# EAGLE board TL-WR703N (EAGLE 6.1), part 1 of 2
TL-WR703N TP-Link 150MB 802.11n Wi-Fi Router Copyright &copy; 2012, Michel Stempin, All rights reserved Licenced under Creative Commons CC BY-SA 3.0 license.
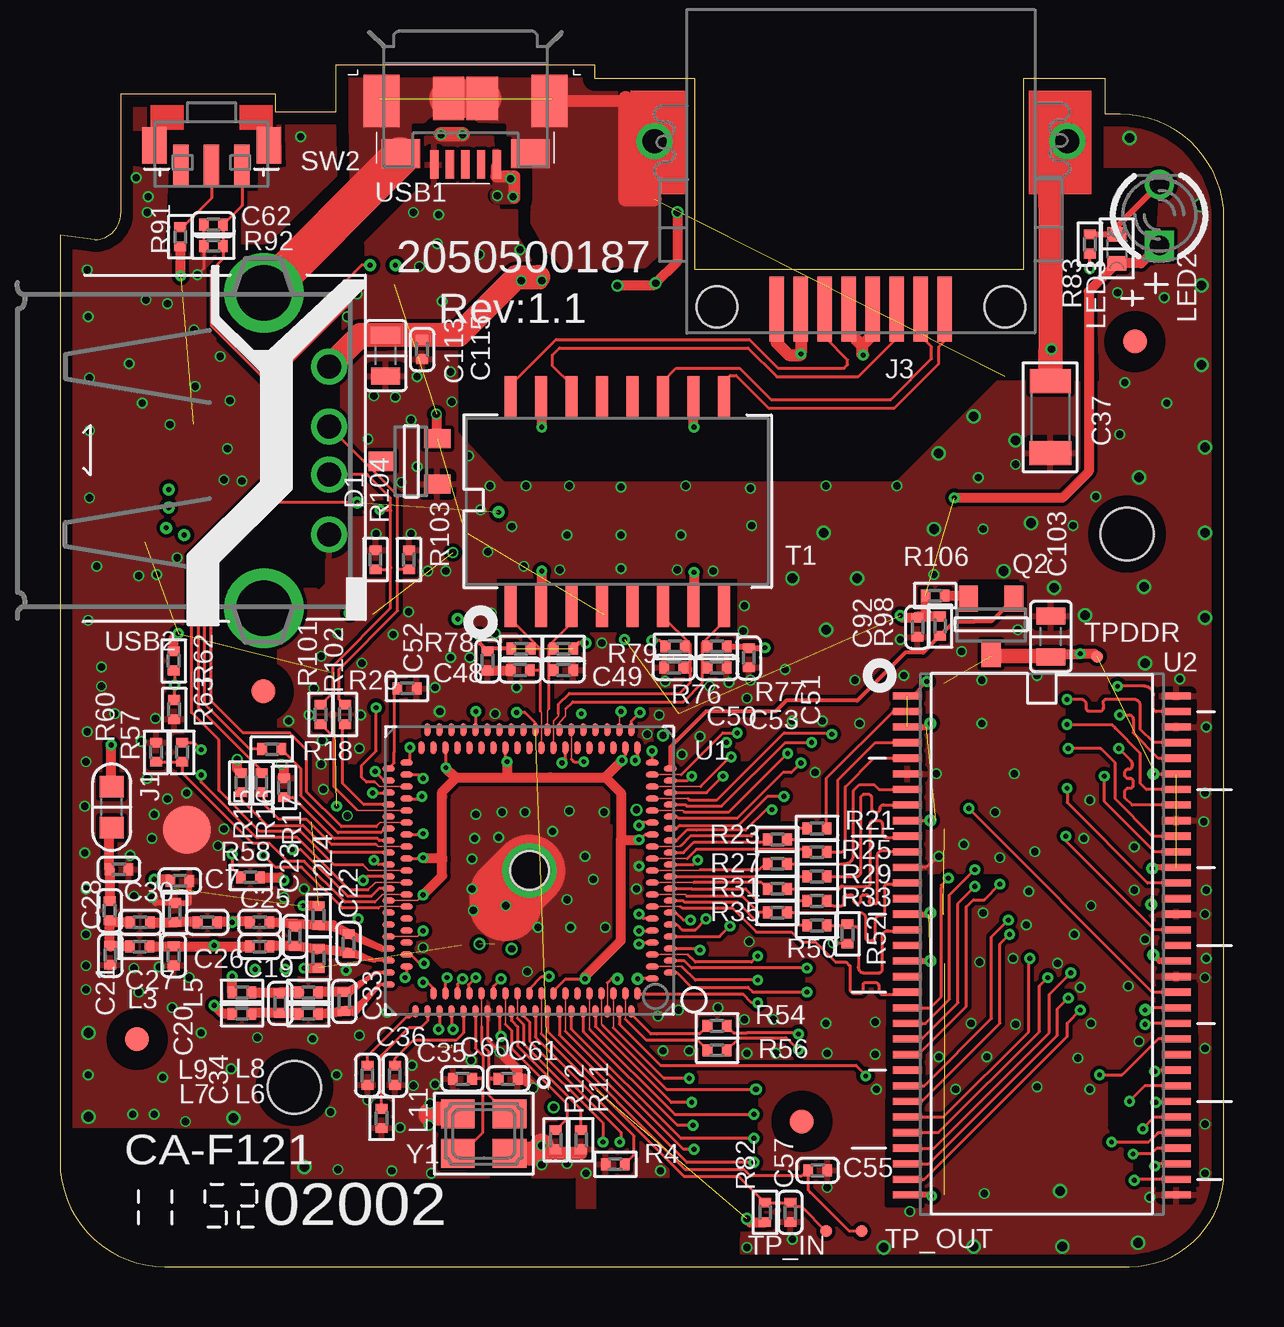
[diagram p2: board, top side]
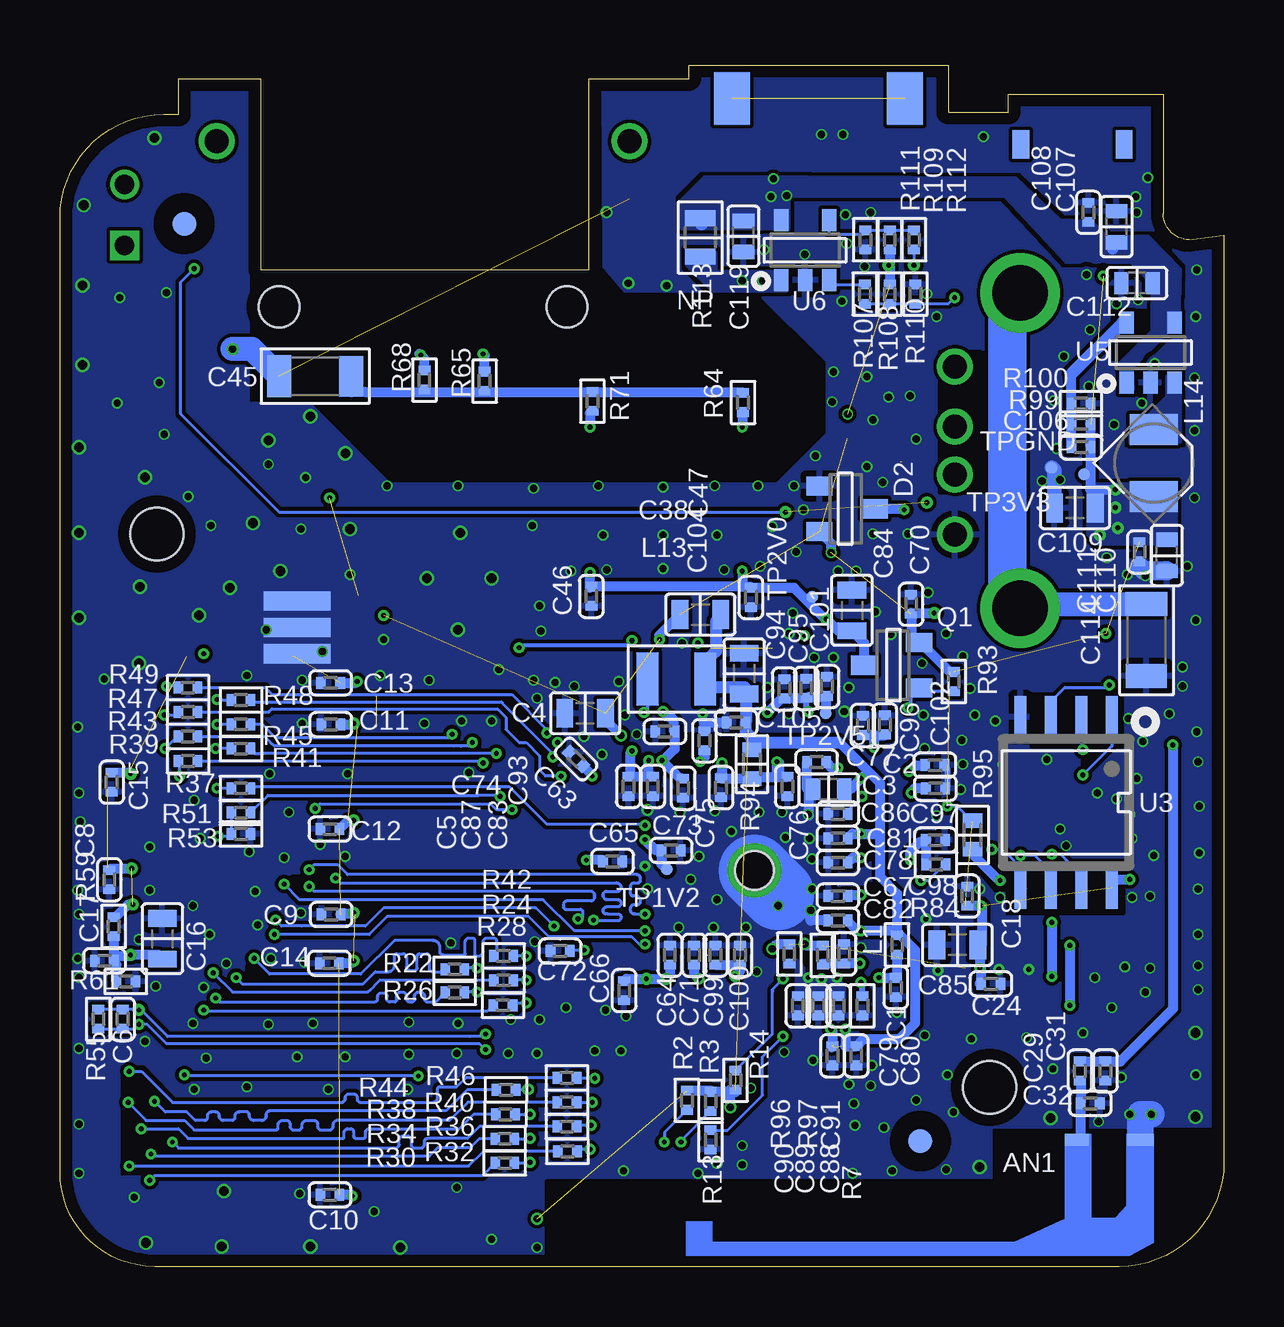
[diagram p3: board, bottom side, seen from below]

Size 48.52 x 50.08 mm. Coordinates in mm from the lower left corner, seen from the top.
Outline: 2.53,48.86 8.98,48.86 8.98,48.11 11.49,48.11 11.49,50.08 22.31,50.08 22.31,49.51 26.47,49.51 26.47,41.55 40.16,41.55 40.16,49.51 43.57,49.51 43.57,48.03 44.19,48.03 arc-90 48.52,43.7 48.52,3.94 arc-90 44.58,0 4.37,0 arc-90 0,4.37 0,43 1.44,42.8
Outline: 2.53,48.86 2.53,43.88
Outline: 1.44,42.8 1.57,42.8 1.68,42.83 1.78,42.86 1.88,42.89 1.98,42.94 2.08,43 2.18,43.08 2.26,43.17 2.37,43.3 2.45,43.47 2.51,43.66 2.53,43.78 2.53,43.88
Copper layers (1*16): Top 0.035mm / dielectric 1mm / Bottom 0.035mm
Design rules: minimum track width 8mil, minimum drill 2mil, track to track 6mil, track to pad 8mil, pad to pad 8mil, via to via 8mil, smd to smd 8mil, copper to edge 20mil, drill to drill 6mil, minimum pad ring 2mil, minimum via ring 2mil, stop-mask expansion 4mil, vias tented up to drill 16mil, thermal gap 10mil
Net classes: 1 RF: clearance 0.508 mm; 2 Power: clearance 0.305 mm
Holes 2.2 mm at 9.77,7.47 44.48,30.53
Holes 1.6 mm at 19.57,16.51

## Footprints (pad centres in the part's own frame; a part is rotated, then mirrored left to right if it is on the bottom)
WIFI_ANTENNA = smd 1.1 x 0.5: GND 2.45,0 | smd 1 x 0.5: RF -0.2,0
C0402 = smd 0.4 x 0.5: 1 -0.4,0; 2 0.4,0
C0603 = smd 0.9 x 0.6: 1 0,0.65; 2 0,-0.65
C0805 = smd 0.7 x 1.2: 1 -0.85,0; 2 0.85,0
C1206 = smd 1 x 1.75: 1 -1.5,0 | smd 1 x 1.7: 2 1.5,0
SOT23-3 = smd 0.8 x 1.1: 1 -0.95,-1.1; 2 0.95,-1.1; 3 0,1.2
FIDUCIAL = smd 1 x 1: 1 0,0
SHIELD_PAD = smd 2 x 2: 1 0,0
GND_3CONTACT = smd 2.8 x 0.8: GND$1 0,1.1; GND$2 0,0; GND$3 0,-1.1
J0603 = smd 0.9 x 1: 1 -0.85,0; 2 0.85,0
RJ45_LP_RA_SMT = smd 0.6 x 2.7: 1 -3.5,0; 2 -2.5,0; 3 -1.5,0; 4 -0.5,0; 5 0.5,0; 6 1.5,0; 7 2.5,0; 8 3.5,0 | drill 1: S$1 -8.6,7; S$2 8.6,7 | hole 1.7: -6,0.1; 6,0.1
L0402 = smd 0.4 x 0.5: 1 -0.4,0; 2 0.4,0
L1008 = smd 2.2 x 0.9: 1 0,1.2; 2 0,-1.2
FERRITE_SELF = smd 2 x 1.3: 1 0,1.4; 2 0,-1.4
LED3MM = drill 0.813 square: A -1.27,0 | drill 0.813: K 1.27,0
LED0603 = smd 0.8 x 0.6: A 0,-0.6; C 0,0.6
R0402 = smd 0.4 x 0.5: 1 -0.4,0; 2 0.4,0
R0603 = smd 0.8 x 0.6: 1 0,0.6; 2 0,-0.6
R0805 = smd 1.27 x 0.66: 1 0,0.8; 2 0,-0.8
TACT_SWITCH_SPST_RA_SMT = smd 0.635 x 1.778: 1 -1.27,0; 2 0,0; 3 1.27,0 | smd 0.7 x 1.2 bottom: P$1 -2.15,0.9; P$2 2.15,0.9 | smd 1.016 x 1.524: S$1 -2.386,0.862; S$2 2.386,0.862
H1601CG = smd 0.5 x 1.8: 1 -4.445,-4.35; 2 -3.175,-4.35; 3 -1.905,-4.35; 4 -0.635,-4.35; 5 0.635,-4.35; 6 1.905,-4.35; 7 3.175,-4.35; 8 4.445,-4.35; 9 4.445,4.325; 10 3.175,4.325; 11 1.905,4.325; 12 0.635,4.325; 13 -0.635,4.325; 14 -1.905,4.325; 15 -3.175,4.325; 16 -4.445,4.325
TEST_PAD = smd 0.5 x 0.5: 1 0,0
DRMLF164 = smd 0.52 x 0.24: A3 -5.869,4.25; A4 -5.869,3.75; A5 -5.869,3.25; A6 -5.869,2.75; A7 -5.869,2.25; A8 -5.869,1.75; A9 -5.869,1.25; A10 -5.869,0.75; A11 -5.869,0.25; A12 -5.869,-0.25; A13 -5.869,-0.75; A14 -5.869,-1.25; A15 -5.869,-1.75; A16 -5.869,-2.25; A17 -5.869,-2.75; A18 -5.869,-3.25; A19 -5.869,-3.75; A20 -5.869,-4.25; A47 5.869,-4.25; A48 5.869,-3.75; A49 5.869,-3.25; A50 5.869,-2.75; A51 5.869,-2.25; A52 5.869,-1.75; A53 5.869,-1.25; A54 5.869,-0.75; A55 5.869,-0.25; A56 5.869,0.25; A57 5.869,0.75; A58 5.869,1.25; A59 5.869,1.75; A60 5.869,2.25; A61 5.869,2.75; A62 5.869,3.25; A63 5.869,3.75; A64 5.869,4.25; A65 5.869,4.75; B1 -5.119,4.5; B2 -5.119,4; B3 -5.119,3.5; B4 -5.119,3; B5 -5.119,2.5; B6 -5.119,2; B7 -5.119,1.5; B8 -5.119,1; B9 -5.119,0.5; B10 -5.119,0; B11 -5.119,-0.5; B12 -5.119,-1; B13 -5.119,-1.5; B14 -5.119,-2; B15 -5.119,-2.5; B16 -5.119,-3; B17 -5.119,-3.5; B18 -5.119,-4; B19 -5.119,-4.5; B39 5.119,-4.5; B40 5.119,-4; B41 5.119,-3.5; B42 5.119,-3; B43 5.119,-2.5; B44 5.119,-2; B45 5.119,-1.5; B46 5.119,-1; B47 5.119,-0.5; B48 5.119,0; B49 5.119,0.5; B50 5.119,1; B51 5.119,1.5; B52 5.119,2; B53 5.119,2.5; B54 5.119,3; B55 5.119,3.5; B56 5.119,4 | smd 0.24 x 0.52: A25 -4.25,-5.869; A26 -3.75,-5.869; A27 -3.25,-5.869; A28 -2.75,-5.869; A29 -2.25,-5.869; A30 -1.75,-5.869; A31 -1.25,-5.869; A32 -0.75,-5.869; A33 -0.25,-5.869; A34 0.25,-5.869; A35 0.75,-5.869; A36 1.25,-5.869; A37 1.75,-5.869; A38 2.25,-5.869; A39 2.75,-5.869; A40 3.25,-5.869; A41 3.75,-5.869; A42 4.25,-5.869; A68 4.75,5.869; A69 4.25,5.869; A70 3.75,5.869; A71 3.25,5.869; A72 2.75,5.869; A73 2.25,5.869; A74 1.75,5.869; A75 1.25,5.869; A76 0.75,5.869; A77 0.25,5.869; A78 -0.25,5.869; A79 -0.75,5.869; A80 -1.25,5.869; A81 -1.75,5.869; A82 -2.25,5.869; A83 -2.75,5.869; A84 -3.25,5.869; A85 -3.75,5.869; A86 -4.25,5.869; B20 -4.5,-5.119; B21 -4,-5.119; B22 -3.5,-5.119; B23 -3,-5.119; B24 -2.5,-5.119; B25 -2,-5.119; B26 -1.5,-5.119; B27 -1,-5.119; B28 -0.5,-5.119; B29 0,-5.119; B30 0.5,-5.119; B31 1,-5.119; B32 1.5,-5.119; B33 2,-5.119; B34 2.5,-5.119; B35 3,-5.119; B36 3.5,-5.119; B37 4,-5.119; B38 4.5,-5.119; B59 4,5.119; B60 3.5,5.119; B61 3,5.119; B62 2.5,5.119; B63 2,5.119; B64 1.5,5.119; B65 1,5.119; B66 0.5,5.119; B67 0,5.119; B68 -0.5,5.119; B69 -1,5.119; B70 -1.5,5.119; B71 -2,5.119; B72 -2.5,5.119; B73 -3,5.119; B74 -3.5,5.119; B75 -4,5.119; B76 -4.5,5.119 | drill 1.5: PAD 0,0
TSOP66 = smd 1.2 x 0.3: 1 -5.6,10.4; 2 -5.6,9.75; 3 -5.6,9.1; 4 -5.6,8.45; 5 -5.6,7.8; 6 -5.6,7.15; 7 -5.6,6.5; 8 -5.6,5.85; 9 -5.6,5.2; 10 -5.6,4.55; 11 -5.6,3.9; 12 -5.6,3.25; 13 -5.6,2.6; 14 -5.6,1.95; 15 -5.6,1.3; 16 -5.6,0.65; 17 -5.6,0; 18 -5.6,-0.65; 19 -5.6,-1.3; 20 -5.6,-1.95; 21 -5.6,-2.6; 22 -5.6,-3.25; 23 -5.6,-3.9; 24 -5.6,-4.55; 25 -5.6,-5.2; 26 -5.6,-5.85; 27 -5.6,-6.5; 28 -5.6,-7.15; 29 -5.6,-7.8; 30 -5.6,-8.45; 31 -5.6,-9.1; 32 -5.6,-9.75; 33 -5.6,-10.4; 34 5.6,-10.4; 35 5.6,-9.75; 36 5.6,-9.1; 37 5.6,-8.45; 38 5.6,-7.8; 39 5.6,-7.15; 40 5.6,-6.5; 41 5.6,-5.85; 42 5.6,-5.2; 43 5.6,-4.55; 44 5.6,-3.9; 45 5.6,-3.25; 46 5.6,-2.6; 47 5.6,-1.95; 48 5.6,-1.3; 49 5.6,-0.65; 50 5.6,0; 51 5.6,0.65; 52 5.6,1.3; 53 5.6,1.95; 54 5.6,2.6; 55 5.6,3.25; 56 5.6,3.9; 57 5.6,4.55; 58 5.6,5.2; 59 5.6,5.85; 60 5.6,6.5; 61 5.6,7.15; 62 5.6,7.8; 63 5.6,8.45; 64 5.6,9.1; 65 5.6,9.75; 66 5.6,10.4
SOP8 = smd 0.508 x 1.778: 1 -1.905,-3.556; 2 -0.635,-3.556; 3 0.635,-3.556; 4 1.905,-3.556; 5 1.905,3.556; 6 0.635,3.556; 7 -0.635,3.556; 8 -1.905,3.556
SOT23-5 = smd 0.6 x 0.9: 1 -1,-1.25; 2 0,-1.25; 3 1,-1.25; 4 1,1.25; 5 -1,1.25
USB-MICROB = smd 0.35 x 1.2: D+ 0,2.65; D- -0.65,2.65; GND 1.3,2.65; ID 0.65,2.65; VBUS -1.3,2.65 | smd 1.5 x 2.2 bottom: P$1 -3.6,-0.1; P$2 3.6,-0.1 | smd 1.5 x 2.2: S$1 -3.5,0; S$6 3.5,0 | smd 1.6 x 1.2: S$2 -2.7,2.2; S$5 2.7,2.2 | smd 1.3 x 1.8: S$3 -0.7,-0.1; S$4 0.7,-0.1
USB-A_TH = drill 1: 1 -3.5,12.99; 2 -1,12.99; 3 1,12.99; 4 3.5,12.99 | drill 2.3 pad 2.8: S$1 -6.57,10.28; S$2 6.57,10.28
CRYSTAL_32_25 = smd 1.4 x 1.2: 1 -1.075,-0.825; 2 1.075,-0.825; 3 1.075,0.825; 4 -1.075,0.825

## Placement (x,y rotation side)
AN1  WIFI_ANTENNA  [WIFI_ANTENNA]  5.93,5.29 0 bottom
C1  1n  [C0402]  13.68,11.63 270 bottom
C2  10n  [C0402]  12.05,20.9 0 bottom
C3  1u 0603  [C0603]  16.48,19.89 270 bottom
C4  10u 0805  [C0805]  26.63,23.06 0 bottom
C5  100n  [C0402]  24.83,20.01 270 bottom
C6  NP  [C0402]  45.9,10.31 90 bottom
C7  100n  [C0402]  5,16.08 0 top
C8  10n  [C0402]  46.46,16.12 270 bottom
C9  10n  [C0402]  37.22,14.68 0 bottom
C10  10n  [C0402]  37.27,2.99 0 bottom
C11  10n  [C0402]  37.23,22.59 0 bottom
C12  10n  [C0402]  37.27,18.23 0 bottom
C13  10n  [C0402]  37.24,24.33 0 bottom
C14  10n  [C0402]  37.29,12.65 0 bottom
C15  10n  [C0402]  46.36,20.19 270 bottom
C16  10u 0805  [C0805]  44.25,13.66 270 bottom
C17  1n  [C0402]  46.66,12.75 0 bottom
C18  12p  [C0402]  10.71,15.44 90 bottom
C19  12p  [C0402]  8.32,13.33 0 top
C20  1p2  [C0402]  4.74,12.95 90 top
C21  1p2  [C0402]  2.1,12.98 90 top
C22  2p4  [C0402]  12.03,13.46 90 top
C23  NP  [C0402]  9.79,13.77 90 top
C24  10p  [C0402]  9.72,11.78 0 bottom
C25  12p  [C0402]  8.32,14.35 0 top
C26  2p4  [C0402]  6.14,14.35 0 top
C27  1p6  [C0402]  3.35,14.35 0 top
C28  12p  [C0402]  2.08,14.83 90 top
C29  0n  [C0402]  6.01,8.15 270 bottom
C30  low ind  [C0402]  2.46,16.56 0 top
C31  0p5  [C0402]  4.94,8.15 270 bottom
C32  NP  [C0402]  5.58,6.8 180 bottom
C33  2p4  [C0402]  11.85,11.05 90 top
C34  2p4  [C0402]  9.18,10.97 90 top
C35  100n  [C0402]  13.96,7.97 90 top
C36  50R  [C0402]  12.82,7.97 90 top
C37  1n 1206  [C1206]  41.28,35.41 90 top
C38  10u 0805  [C0805]  21.83,27.17 180 bottom
C45  1n 1206  [C1206]  37.88,37.11 0 bottom
C46  100n  [C0402]  26.37,27.94 270 bottom
C47  10n  [C0402]  19.72,27.89 270 bottom
C48  12p  [C0402]  19.19,24.87 0 top
C49  12p  [C0402]  20.99,24.87 0 top
C50  12p  [C0402]  25.59,24.96 0 top
C51  100n  [C0402]  28.71,25.37 90 top
C52  100n  [C0402]  17.82,25.25 90 top
C53  12p  [C0402]  27.39,24.96 0 top
C55  NP  [C0402]  31.58,4.01 0 top
C57  NP  [C0402]  30.44,2.26 90 top
C60  12p  [C0402]  16.78,7.82 0 top
C61  12p  [C0402]  18.68,7.82 0 top
C62  100p  [C0402]  6.39,43.43 0 top
C63  10n  [C0402]  27.01,21.16 315 bottom
C64  10n  [C0402]  23.1,12.98 270 bottom
C65  10n  [C0402]  25.48,16.89 0 bottom
C66  10n  [C0402]  25,11.5 90 bottom
C67  10n  [C0402]  16.09,15.44 0 bottom
C70  10n  [C0402]  13.04,27.61 270 bottom
C71  10n  [C0402]  22.08,12.98 270 bottom
C72  10n  [C0402]  27.67,13.15 0 bottom
C73  10n  [C0402]  23.05,17.35 0 bottom
C74  10n  [C0402]  23.3,22.3 0 bottom
C75  10n  [C0402]  20.97,19.96 270 bottom
C76  10n  [C0402]  18.2,20.01 270 bottom
C77  10n  [C0402]  16.98,21.03 0 bottom
C78  10n  [C0402]  16.09,16.84 0 bottom
C79  10n  [C0402]  16.32,8.79 270 bottom
C80  10n  [C0402]  15.33,8.79 270 bottom
C81  10n  [C0402]  16.09,17.85 0 bottom
C82  10n  [C0402]  16.09,14.42 0 bottom
C83  10n  [C0402]  22.54,19.94 270 bottom
C84  10u 0805  [C0805]  15.51,27.35 270 bottom
C85  22u 0805  [C0805]  11.12,13.41 0 bottom
C86  10n  [C0402]  16.09,18.87 0 bottom
C87  10n  [C0402]  23.81,20.01 270 bottom
C88  10n  [C0402]  16.06,10.87 270 bottom
C89  10n  [C0402]  16.9,10.87 270 bottom
C90  10n  [C0402]  17.77,10.87 270 bottom
C91  10n  [C0402]  15.84,13.03 270 bottom
C92  10n  [C0402]  35.74,26.64 90 top
C93  10n  [C0402]  21.65,21.92 270 bottom
C94  10n  [C0402]  18.33,24.08 270 bottom
C95  100n  [C0402]  17.41,24.1 270 bottom
C96  100n  [C0402]  15.05,22.56 270 bottom
C97  10n  [C0402]  12.03,19.94 0 bottom
C98  10n  [C0402]  12.03,17.78 0 bottom
C99  10n  [C0402]  21.19,12.98 270 bottom
C100  100n  [C0402]  20.18,12.98 270 bottom
C101  10n  [C0402]  16.55,24.18 270 bottom
C102  10n  [C0402]  14.14,22.58 270 bottom
C103  10u 0805  [C0805]  41.31,26.26 90 top
C104  22u 0805  [C0805]  20,24.71 90 bottom
C105  100n  [C0402]  20.33,22.68 180 bottom
C106  22p  [C0402]  5.96,34.16 0 bottom
C107  4u7 0603  [C0603]  4.48,43.34 0 bottom
C108  100n  [C0402]  5.65,43.94 270 bottom
C109  10u 0805  [C0805]  6.21,31.62 0 bottom
C110  NP  [C0603]  2.38,29.64 0 bottom
C111  100n  [C0402]  3.52,29.79 270 bottom
C112  4u7 0603  [C0603]  3.63,40.99 270 bottom
C113  10u 0805  [C0805]  13.58,37.97 90 top
C114  1n 1206  [C1206]  3.24,26.11 270 bottom
C115  100n  [C0402]  15.1,38.22 90 top
C119  1u 0603  [C0603]  20.03,42.94 0 bottom
D1  MMBD7000  [SOT23-3]  14.62,33.56 90 top
D2  MMBD7000  [SOT23-3]  15.76,31.59 270 bottom
E$1  FIDUCIAL  [FIDUCIAL]  3.22,9.47 0 top
E$2  FIDUCIAL  [FIDUCIAL]  30.92,6.05 0 top
E$3  FIDUCIAL  [FIDUCIAL]  44.81,38.55 0 top
E$4  FIDUCIAL  [FIDUCIAL]  8.48,23.98 0 top
E$5  FIDUCIAL  [FIDUCIAL]  43.33,43.46 0 bottom
E$6  FIDUCIAL  [FIDUCIAL]  12.66,5.23 0 bottom
E$7  CC-BY-SA  [CC-BY-SA]  49.97,10.51 0 top
GND  TEST_PAD_SHIELD  [SHIELD_PAD]  5.3,18.21 0 top
GND_CONTACTS  GND_3CONTACTS  [GND_3CONTACT]  38.63,26.64 0 bottom
J1  JUMPER  [J0603]  2.15,19.15 90 top
J3  RJ45_2SH  [RJ45_LP_RA_SMT]  33.38,39.9 0 top
L1  0R  [L0402]  13.63,13.41 90 bottom
L2  low ind  [L0402]  10.78,12.85 90 top
L3  low ind  [L0402]  3.32,13.33 0 top
L4  low ind  [L0402]  10.78,14.63 90 top
L5  low ind  [L0402]  4.79,14.75 90 top
L6  low ind  [L0402]  10.35,10.54 180 top
L7  low ind  [L0402]  7.59,10.54 180 top
L8  low ind  [L0402]  10.35,11.43 180 top
L9  low ind  [L0402]  7.59,11.43 180 top
L11  50R  [L0402]  13.4,6.17 90 top
L13  1u  [L1008]  22.83,24.49 270 bottom
L14  4u  [FERRITE_SELF]  2.93,33.49 180 bottom
LED2  NP  [LED3MM]  45.82,43.84 90 top
LED3  Blue LED  [LED0603]  44.05,42.41 0 top
Q1  S8550M  [SOT23-3]  13.81,25.07 90 bottom
Q2  S8550M  [SOT23-3]  38.82,26.74 180 top
R2  10k  [R0402]  22.39,6.93 270 bottom
R3  10k  [R0402]  21.4,6.88 270 bottom
R4  10k  [R0402]  23.15,4.27 180 top
R7  6k2  [R0402]  15.08,10.87 270 bottom
R11  10k  [R0402]  21.73,5.28 90 top
R12  10k  [R0402]  20.66,5.28 90 top
R13  10k  [R0402]  21.4,5.28 270 bottom
R14  10k  [R0402]  20.36,7.77 270 bottom
R15  10k  [R0402]  7.56,20.17 270 top
R16  0R  [R0402]  8.4,20.17 270 top
R17  10k  [R0402]  9.34,19.96 270 top
R18  0R  [R0402]  8.83,21.56 0 top
R20  2k4  [R0402]  14.47,24.1 0 top
R21  22R  [R0402]  31.55,18.26 180 top
R22  22R  [R0402]  32.06,12.39 180 bottom
R23  22R  [R0402]  29.9,17.8 180 top
R24  22R  [R0402]  30.03,11.93 180 bottom
R25  22R  [R0402]  31.55,17.27 180 top
R26  22R  [R0402]  32.06,11.43 180 bottom
R27  22R  [R0402]  29.9,16.79 180 top
R28  22R  [R0402]  30.06,10.89 180 bottom
R29  22R  [R0402]  31.55,16.26 180 top
R30  22R  [R0402]  29.98,4.31 180 bottom
R31  22R  [R0402]  29.9,15.75 180 top
R32  22R  [R0402]  27.37,4.8 180 bottom
R33  22R  [R0402]  31.55,15.24 180 top
R34  22R  [R0402]  29.98,5.33 180 bottom
R35  22R  [R0402]  29.9,14.75 180 top
R36  22R  [R0402]  27.39,5.84 180 bottom
R37  22R  [R0402]  40.98,19.94 180 bottom
R38  22R  [R0402]  29.95,6.35 180 bottom
R39  22R  [R0402]  43.18,21.08 180 bottom
R40  22R  [R0402]  27.39,6.85 180 bottom
R41  22R  [R0402]  40.98,21.59 180 bottom
R42  22R  [R0402]  30.03,12.95 180 bottom
R43  22R  [R0402]  43.18,22.09 180 bottom
R44  22R  [R0402]  29.93,7.36 180 bottom
R45  22R  [R0402]  40.98,22.6 180 bottom
R46  22R  [R0402]  27.39,7.87 180 bottom
R47  22R  [R0402]  43.18,23.11 180 bottom
R48  22R  [R0402]  40.98,23.62 180 bottom
R49  22R  [R0402]  43.18,24.13 180 bottom
R50  22R  [R0402]  31.55,14.22 180 top
R51  22R  [R0402]  40.98,18.92 180 bottom
R52  10k  [R0402]  32.82,13.87 270 top
R53  10k  [R0402]  40.98,18.03 180 bottom
R54  22R  [R0402]  27.39,10.03 0 top
R55  100R  [R0402]  46.92,10.31 90 bottom
R56  22R  [R0402]  27.39,9.02 0 top
R57  1k  [R0402]  5.1,21.44 270 top
R58  10k  [R0402]  7.94,16.23 180 top
R59  6k2  [R0402]  46.28,14.17 270 bottom
R60  3k  [R0402]  4.01,21.44 270 top
R61  6k2  [R0402]  45.77,11.88 0 bottom
R62  10k  [R0402]  4.74,25.25 270 top
R63  NP  [R0402]  4.76,23.21 270 top
R64  75R  [R0402]  20.05,36.01 270 bottom
R65  75R  [R0402]  30.82,36.9 270 bottom
R68  75R  [R0402]  33.33,36.95 270 bottom
R71  75R  [R0402]  26.32,36.06 270 bottom
R76  50R  [R0402]  25.64,25.85 0 top
R77  50R  [R0402]  27.39,25.85 0 top
R78  50R  [R0402]  19.22,25.75 0 top
R79  50R  [R0402]  20.99,25.75 0 top
R82  10k  [R0402]  29.39,2.26 90 top
R83  3k8  [R0402]  42.93,42.62 90 top
R84  10k  [R0402]  12,16.76 0 bottom
R91  1k  [R0402]  5.02,42.92 90 top
R92  3k  [R0402]  6.39,42.54 0 top
R93  NP  [R0402]  11.27,24.38 90 bottom
R94  0R 0603  [R0603]  19.68,20.94 0 bottom
R95  10R 0603  [R0603]  10.48,17.99 0 bottom
R96  0R  [R0402]  18.12,13.03 90 bottom
R97  0R  [R0402]  16.73,12.98 90 bottom
R98  NP  [R0402]  36.68,26.69 90 top
R99  299k  [R0402]  5.96,35.12 0 bottom
R100  66k4  [R0402]  5.96,35.96 180 bottom
R101  0R  [R0402]  10.86,23.01 270 top
R102  0R  [R0402]  11.88,23.01 270 top
R103  NP  [R0402]  14.54,29.46 90 top
R104  NP  [R0402]  13.15,29.46 90 top
R106  0R  [R0402]  36.48,27.96 180 top
R107  0R  [R0402]  14.97,40.53 90 bottom
R108  1k  [R0402]  13.93,40.53 90 bottom
R109  1k  [R0402]  13.93,42.79 90 bottom
R110  3k  [R0402]  12.87,40.53 90 bottom
R111  3k  [R0402]  14.95,42.79 90 bottom
R112  0R  [R0402]  12.92,42.79 90 bottom
R113  NP  [R0805]  21.83,42.89 0 bottom
SW2  TACT_SWITCH_SPST  [TACT_SWITCH_SPST_RA_SMT]  6.32,45.87 0 top
T1  ETH10_100_TRANSFO  [H1601CG]  23.23,31.9 0 top
TP1V2  TEST_PAD  [TEST_PAD]  23.23,16.56 0 bottom
TP2V0  TEST_PAD  [TEST_PAD]  17.16,27.91 0 bottom
TP2V5  TEST_PAD  [TEST_PAD]  16.6,23.06 0 bottom
TP3V3  TEST_PAD  [TEST_PAD]  5.83,33.02 0 bottom
TP_IN  TEST_PAD  [TEST_PAD]  31.93,1.47 0 top
TP_OUT  TEST_PAD  [TEST_PAD]  33.41,1.47 0 top
TPDDR  TEST_PAD  [TEST_PAD]  43.23,25.42 0 top
TPGND  TEST_PAD  [TEST_PAD]  7.18,33.3 0 bottom
U1  AR9331-AL1A  [DRMLF164]  19.57,16.51 180 top
U2  A3S56F40FTP  [TSOP66]  40.92,13.38 0 top
U3  S25FL032P0XMFI01  [SOP8]  6.58,19.34 180 bottom
U5  UNKNOWN_BUCK  [SOT23-5]  3.06,38.1 0 bottom
U6  TPS2041BDBV  [SOT23-5]  17.46,42.36 0 bottom
USB1  USB-MICROB  [USB-MICROB]  16.9,48.59 180 top
USB2  USB-A_TH  [USB-A_TH]  -1.78,34.01 270 top
Y1  25.00 MHz  [CRYSTAL_32_25]  17.66,5.54 180 top

## Tracks (layer width: path | path; a pad name or v marks a point on that pad's centre or on a via)
!CAS  (via drill 0.2 pad 0.45)
  Top 0.127: U2.22 36.07,10.13 37.08,11.14 37.08,15.49 38.03,16.44 v38.13,16.54 | U1.B6 24.31,14.51 v24.13,14.69 | v24.13,14.69 | v24.13,14.69
  Bottom 0.127: v38.13,16.54 37.93,16.74 36.93,16.74 36.53,16.34 24.48,16.34 arc90 24.33,16.19 24.33,16.09 arc90 24.43,15.99 24.58,15.99 arc-90 24.73,15.84 24.73,15.54 arc-90 24.63,15.44 24.48,15.44 arc90 24.33,15.29 24.33,15.19 arc90 24.43,15.09 24.58,15.09 arc-90 24.73,14.94 24.73,14.84 arc-90 24.58,14.69 | 24.53,14.69 24.58,14.69 | 24.58,14.69 v24.13,14.69 | v24.13,14.69 | v24.13,14.69
!CLK
  Top 0.127: U1.A86 23.82,10.5 24.63,9.69 24.88,9.69 26.65,9.69 R54.1
!CLK_B  (via drill 0.2 pad 0.45, 0.2 pad 0.5)
  Top 0.127: U2.46 45.32,10.79 v45.23,10.69 | v30.78,9.69 30.73,9.74 28.63,9.74 28.08,9.74 R54.2
  Bottom 0.127: 31.43,9.59 44.03,9.59 45.13,10.69 v45.23,10.69 45.28,10.74 45.93,10.74 | 46.83,10.71 46.83,10.69 | 46.83,10.71 46.8,10.74 45.93,10.74 | v30.78,9.69 30.88,9.59 31.43,9.59 | 46.83,10.71 R55.2 | C6.2 45.93,10.74 | 31.43,9.59 | 31.43,9.59
!CS  (via drill 0.2 pad 0.45)
  Top 0.127: U2.24 35.77,8.83 37.78,10.84 37.78,14.99 38.08,15.29 38.53,15.29 v39.18,15.94 | v24.13,13.99 24.67,13.99 U1.B5
  Bottom 0.127: v24.13,13.99 27.08,13.99 28.38,15.29 38.53,15.29 v39.18,15.94
!RAS  (via drill 0.2 pad 0.45)
  Top 0.127: U1.A7 25.71,14.26 25.93,14.04 26.48,14.04 v26.93,14.49 | U2.23 35.92,9.48 37.43,10.99 37.43,15.14 v38.13,15.84
  Bottom 0.127: v38.13,15.84 37.93,15.64 26.38,15.64 arc90 26.23,15.44 arc90 26.38,15.24 27.38,15.24 arc-90 27.53,15.09 27.53,14.99 arc-90 27.43,14.89 26.83,14.89 arc90 26.73,14.79 26.73,14.59 arc90 26.83,14.49 v26.93,14.49
!SPI_CS_0  (via drill 0.2 pad 0.45)
  Top 0.064: U1.B49 13.15,16.01 12.83,15.69
  Top 0.127: 8.18,17.89 5.88,20.19 v5.88,20.49 | 12.83,15.69 12.08,15.69 9.88,17.89 8.28,17.89 | 8.28,17.89 8.18,17.89 | 8.18,17.89 8.28,17.89 | 8.28,17.89
  Bottom 0.127: U3.1 4.68,21.7 v5.88,20.49
!SPI_W  (via drill 0.2 pad 0.45)
  Top 0.127: R62.2 4.78,24.85 v4.78,24.24 | R63.1 4.78,23.61 v4.78,24.24 | v4.78,24.24 | v4.78,24.24
  Bottom 0.127: v4.78,24.24 4.88,24.14 6.63,24.14 7.22,23.56 U3.3
!WE  (via drill 0.2 pad 0.45)
  Top 0.127: U1.A8 25.66,14.76 25.98,14.44 v26.28,14.44 | U2.21 36.27,10.79 36.73,11.24 36.73,15.79 36.73,15.89 v37.03,16.19
  Bottom 0.127: v37.03,16.19 36.83,15.99 25.33,15.99 arc90 25.13,15.79 arc90 25.28,15.64 25.73,15.64 arc-90 25.88,15.49 arc-90 25.73,15.29 25.28,15.29 arc90 25.13,15.14 arc90 25.28,14.99 25.73,14.99 arc-90 25.88,14.84 arc-90 25.78,14.69 25.68,14.69 25.23,14.69 arc90 25.13,14.54 arc90 25.26,14.42 26.26,14.42 v26.28,14.44
$28  (via drill 0.2 pad 0.45)  (1 unrouted)
  Top 0.127: 17.83,25.64 C52.2
  Top 0.175: v21.93,25.99 21.63,25.99 R79.2 | R78.1 17.94,25.75 17.83,25.64 | v17.48,26.29 17.48,25.98 C52.2
+1V2  (via drill 0.2 pad 0.45)
  Top 0.064: U1.A58 14.9,15.26 v15.13,15.49 | U1.A26 23.32,22.88 23.43,22.99
  Top 0.127: v21.88,11.99 21.08,11.99 20.57,11.48 U1.B69 | U1.B36 16.07,20.8 v16.08,20.79 | v16.08,20.79 | v16.08,20.79 | v20.93,20.99 21.08,21.14 21.08,21.49 | 21.08,21.49 21.08,21.64 | U1.B26 21.07,21.5 21.08,21.49 | U1.B21 23.58,21.64 23.58,21.34 23.33,21.09 v23.43,21.09 | U1.B47 15.15,17.01 15.18,17.04 v15.13,17.04 | v15.13,17.04 | v15.13,17.04 | 24.18,17.79 24.39,18 U1.B13 24.68,17.99 U1.B13 | v24.13,17.79 24.18,17.79 | 24.18,17.79 | 18.53,21.59 U1.B31 18.57,21.1 v18.63,21.04 | 23.43,22.99 23.43,23.09 v23.38,23.14 | v23.43,21.09 | 22.78,20.39 22.78,20.34 22.81,20.32
  Top 0.406: v15.13,15.49 15.93,16.29 15.93,16.94 | 15.93,16.94 15.93,16.99 15.93,19.59 15.93,19.79 16.53,20.39 | 23.38,17.79 v24.13,17.79 23.38,17.79 | 23.38,17.79 23.38,13.59 21.88,12.09 v21.88,11.99 | 16.53,20.39 18.63,20.39 | 18.63,20.39 | 18.63,20.39 | 18.63,20.39 20.43,20.39 22.68,20.39 22.73,20.39 22.81,20.32 23.38,19.74 23.38,17.79 | 23.38,17.79 | 16.53,20.39 16.48,20.39 v16.08,20.79 | v18.63,21.04 18.63,20.39 | 18.63,20.39 | v15.13,17.04 15.18,17.04 15.93,17.04 15.93,16.94 | 22.78,20.39 22.78,20.44 v23.43,21.09
  Bottom 0.127: 22.93,22.79 23.03,22.79 v23.38,23.14 | v23.43,21.09 | v23.43,21.09 | 20.98,20.39 20.98,20.38 C75.1 | 15.68,15.49 C67.2 | v21.88,11.99 | v21.88,11.99
  Bottom 0.406: v20.93,20.99 20.93,20.44 | 20.93,20.44 20.98,20.39 20.98,20.49 | 18.53,20.41 19.68,20.41 R94.2 20.93,20.34 20.93,20.44 | 18.53,20.41 C76.1 18.53,20.41 | C71.2 22.08,12.19 v21.88,11.99 | v24.13,17.79 23.68,17.35 C73.1 23.45,16.78 TP1V2.1 | C83.1 22.57,20.34 22.67,20.34 v23.43,21.09 23.38,21.09 22.98,21.49 22.9,21.57 C74.2 22.93,22.33 22.93,22.79 | 18.53,20.41 18.53,20.99 | v15.13,17.04 15.49,17.04 C78.2 | C77.2 16.34,20.79 v16.08,20.79 | v23.38,23.14 23.13,22.89 23.03,22.89 | 15.68,15.49 v15.13,15.49 | v15.13,15.49 | 18.53,20.41 18.55,20.39 18.63,20.39 | 18.63,20.39 | 18.63,20.39 v18.63,21.04
+2V0  (via drill 0.2 pad 0.45, 0.2 pad 0.5)
  Top 0.406: v20.08,28.99 20.08,27.54 20.08,27.55 T1.2 | v26.43,28.94 26.43,28.29 26.43,27.54 26.43,27.55 T1.7
  Bottom 0.127: v16.58,26.99 | v16.58,26.99
  Bottom 0.406: Q1.3 15.01,26 C84.2 16.09,26.5 v16.58,26.99 | TP2V0.1 17.21,27.91 17.21,27.86 17.36,27.72 | v16.58,26.99 16.58,26.94 | v26.43,28.94 26.43,28.29 26.43,28.34 C46.1 20.08,28.34 | v20.08,28.99 20.08,28.34 | 20.08,28.34 19.73,28.34 19.72,28.34 C47.1 17.92,28.29 17.36,27.72 | 17.36,27.72 16.63,26.99 v16.58,26.99
+2V5  (via drill 0.2 pad 0.45, 0.3 pad 0.5)  (2 unrouted)
  Top 0.127: v17.33,23.14 17.33,22.39 17.32,22.39 U1.A38 | v17.33,23.14 | v17.33,23.14 | v19.03,23.09 19.38,23.09 19.82,22.65 U1.A33 | R82.1 29.38,1.84
  Top 0.406: v28.63,1.99 28.78,1.84 29.38,1.84
  Bottom 0.127: 17.28,23.74 17.41,23.74 C95.2 17.43,23.69 | C101.2 16.58,23.78 16.58,23.74
  Bottom 0.254: v17.33,23.14 17.41,23.14 C95.2
  Bottom 0.406: 17.43,23.69 18.33,23.69 C94.2 18.45,23.68 v19.03,23.09 | 17.28,23.74 16.58,23.74 16.53,23.74 16.53,23.7 | C101.2 16.6,23.73 TP2V5.1 | 20.36,7.28 R14.2 20.58,7.37 | v20.58,6.64 20.58,7.37 | R2.1 21.4,7.33 R3.1 20.58,7.28 20.58,7.37
+3V3  (via drill 0.2 pad 0.45, 0.2 pad 0.5, 0.3 pad 0.2, 0.3 pad 0.5)  (16 unrouted)
  Top 0.127: 4.98,42.49 R91.1 5.03,42.49 | L2.1
  Top 0.406: C7.1 4.53,16.14 v3.93,16.14 | R62.1 4.74,26.2 v4.93,26.39 | R98.2 35.8,27.09 C92.2 | 35.7,27.09 C92.2 | R106.2 36.08,27.09 35.73,27.09 35.74,27.08 C92.2 | v35.03,27.14 35.13,27.04 C92.2 | 4.98,42.49 4.99,42.49 | v5.03,41.29 | v5.03,41.29 5.03,42.49 | v15.69,35.53 15.69,34.54 D1.2 | L4.2 10.13,15.03 v10.13,15.04 | v10.13,15.04 | v10.13,15.04 | v10.17,12.45 v10.18,12.44 L2.1 | LED2.A 45.07,41.81 LED3.A 42.88,40.65 42.88,33.14 41.78,32.04 v37.28,32.04
  Bottom 0.127: 5.58,34.24 5.56,34.22 C106.2 | TP3V3.1 5.83,32.99 | v11.53,19.19 11.13,19.19 10.48,18.54 R95.1 | R95.1 | R97.2 16.73,13.39 R97.2 | R97.2 | v10.18,12.44 | v10.18,12.44 | v18.83,13.24 | v18.83,13.24 | 11.43,24.79 11.27,24.79 R93.2 | 12.78,25.99 12.71,25.99 Q1.2 | 13.03,27.24 13.04,27.24 C70.2
  Bottom 0.406: R99.2 5.58,35.12 5.58,34.24 5.58,33.24 | 5.58,33.24 5.83,32.99 | 5.58,33.24 5.58,32.39 v4.53,32.39 | U3.8 4.68,16.14 v3.93,16.14 | C4.2 25.78,22.79 v25.13,22.14 | D2.2 16.38,30.15 16.38,29.75 | R109.1 13.93,41.79 v13.98,41.74 13.93,41.69 R108.2 | v17.48,13.44 17.42,13.38 R97.2 | C85.2 10.13,13.41 | C85.2 10.08,13.41 10.08,15.04 | 10.18,11.78 C24.1 10.12,12.44 v10.18,12.44 10.18,13.41 | C85.2 10.18,13.41 | C85.2 10.18,13.41 | C18.1 v10.13,15.04 10.08,15.04 | 10.08,15.04 | R96.2 18.65,13.43 v18.83,13.24 | 11.43,24.79 12.63,25.99 12.78,25.99 13.03,25.99 13.03,27.14 13.03,27.24 v12.08,27.24 | C38.2 23.53,26.32 v23.53,26.14
  other vias: 4.53,31.64 4.43,30.79 5.18,30.49
  pour Bottom (no thermals): 1.98,32.64 1.98,30.09 5.28,30.09 5.68,30.49 5.68,32.64
+5V0  (via drill 0.3 pad 0.2)
  Top 0.406: 18.18,45.44 18.18,45.89
  Top 0.5: 18.18,45.44 18.93,45.44 18.93,44.54
  Bottom 0.406: 4.66,42.39 4.63,42.39
  Bottom 0.5: C119.1 20.08,43.54
  Bottom 0.6: 21.78,43.49 21.78,43.59
  other vias: 18.23,44.64 18.88,44.59 18.78,45.34
  pour Bottom (no thermals): 4.28,36.44 4.33,37.69 2.98,39.04 2.98,40.94 3.88,41.84 6.58,41.84 9.13,44.59 18.13,44.59 18.13,43.24 22.63,43.24 22.63,44.44 21.63,45.44 8.68,45.39 6.83,43.64 5.53,43.59 5.53,43.59 4.88,42.94 4.88,42.94 3.13,42.94 1.83,41.59 1.88,39.39 3.83,37.44 3.78,36.54
  pour Top (no thermals): 18.28,44.34 18.68,44.34 arc90 19.08,44.59 19.13,45.34 arc90 18.93,45.59 18.28,45.59 18.28,46.54 18.08,46.54 18.08,44.84 arc90 17.98,44.69 17.98,44.54 arc90
A0  (via drill 0.2 pad 0.45)
  Top 0.127: U1.A4 26.01,12.76 26.33,12.44 v31.13,12.44
  Bottom 0.127: v31.13,12.44 31.63,12.44 31.63,12.39 R22.1
A0_B  (via drill 0.2 pad 0.45)
  Top 0.127: U2.29 36.62,5.58 40.83,9.79 40.83,11.69 v41.18,12.04
  Bottom 0.127: v41.18,12.04 40.93,11.79 35.88,11.79 35.38,12.29 34.88,12.29 34.83,12.29 arc-90 34.58,12.54 34.58,12.94 arc90 34.48,13.04 34.23,13.04 arc90 34.08,12.89 34.08,12.49 arc-90 33.93,12.34 33.73,12.34 arc-90 33.63,12.44 33.63,12.94 arc90 33.53,13.04 33.23,13.04 arc90 33.13,12.94 33.13,12.44 arc-90 32.98,12.29 32.63,12.29 32.48,12.44 32.46,12.44 R22.2
A1  (via drill 0.2 pad 0.45)
  Top 0.064: U1.B2 25.91,12.51
  Top 0.127: 25.91,12.51 26.48,11.94 v29.08,11.94
  Bottom 0.127: 29.62,11.94 R24.1 29.63,11.94 v29.08,11.94
A1_B  (via drill 0.2 pad 0.45)
  Top 0.127: U2.30 36.42,4.93 41.23,9.74 41.23,11.34 v42.13,12.24
  Bottom 0.127: v42.13,12.24 41.33,11.44 36.33,11.44 35.68,11.44 35.58,11.54 35.29,11.83 35.19,11.93 R24.2
A2  (via drill 0.2 pad 0.45)
  Top 0.127: U1.A3 25.71,12.26 26.33,11.64 28.68,11.64 28.88,11.44 31.08,11.44 v31.13,11.44
  Bottom 0.127: v31.13,11.44 31.58,11.44 31.63,11.39 31.66,11.39 R26.1
A2_B  (via drill 0.2 pad 0.45)
  Top 0.127: U2.31 36.22,4.29 41.58,9.64 41.58,10.74 v42.03,11.19
  Bottom 0.127: v42.03,11.19 41.88,11.04 35.38,11.04 arc-90 35.28,11.14 35.28,11.24 arc90 35.18,11.39 34.98,11.39 arc90 34.88,11.24 34.88,11.09 arc-90 34.73,11.04 34.58,11.04 arc-90 34.48,11.09 34.48,11.19 34.48,11.24 arc90 34.33,11.44 34.23,11.44 arc90 34.08,11.24 34.08,11.14 arc-90 33.88,11.04 33.83,11.04 arc-90 33.73,11.14 33.73,11.29 arc90 33.58,11.44 33.48,11.44 arc90 33.33,11.29 33.33,11.19 arc-90 33.23,11.04 32.85,11.04 R26.2
A3  (via drill 0.2 pad 0.45)
  Top 0.127: 24.07,11.34 U1.B76 24.12,11.34 28.48,11.34 28.83,10.99 28.88,10.99 v29.08,10.99
  Bottom 0.127: R28.1 29.56,10.99 v29.08,10.99
A3_B  (via drill 0.2 pad 0.45)
  Top 0.127: U2.32 35.32,3.64 36.03,3.64 41.98,9.59 41.98,10.14 v42.53,10.69 | v42.53,10.69 | v42.53,10.69
  Bottom 0.127: R28.2 30.71,10.64 42.23,10.64 42.48,10.64 v42.53,10.69
A4  (via drill 0.2 pad 0.45)
  Top 0.127: v28.93,4.34 26.13,4.34 | U1.A80 20.82,9.65 26.13,4.34 | 26.13,4.34 | 26.13,4.34
  Bottom 0.127: R30.1 28.96,4.31 v28.93,4.34
A4_B  (via drill 0.2 pad 0.45)
  Top 0.127: U2.35 44.82,3.63 v44.78,3.59 | v44.78,3.59 | v44.78,3.59
  Bottom 0.127: v44.78,3.59 44.58,3.79 43.88,3.79 30.9,3.79 R30.2
A5  (via drill 0.2 pad 0.45)
  Top 0.064: U1.B70 21.07,9.8
  Top 0.127: 21.07,9.8 25.98,4.89 v26.43,4.89
  Bottom 0.127: v26.43,4.89 26.98,4.89 | 26.98,4.89 27.08,4.79 | 26.98,4.89 26.97,4.88 R32.1
A5_B  (via drill 0.2 pad 0.45)
  Top 0.127: U2.36 45.72,4.29 v45.63,4.19
  Bottom 0.127: v45.63,4.19 31.48,4.19 30.88,4.79 30.87,4.8 R32.2
A6  (via drill 0.2 pad 0.45)
  Top 0.127: v28.93,5.34 25.88,5.34 21.33,9.89 21.33,10.63 U1.A81
  Bottom 0.127: R34.1 28.94,5.33 | 28.94,5.33 v28.93,5.34 | 28.94,5.33 v28.93,5.34 | v28.93,5.34
A6_B  (via drill 0.2 pad 0.45)
  Top 0.127: U2.37 45.72,4.93 45.48,4.69 v44.73,4.69
  Bottom 0.127: R34.2 31.04,5.33 31.43,4.94 32.78,4.94 33.13,4.59 44.63,4.59 v44.73,4.69
A7  (via drill 0.2 pad 0.45)
  Top 0.127: v26.38,5.89 25.73,5.89 21.83,9.79 21.83,10.64 U1.A82
  Bottom 0.127: v26.38,5.89 26.98,5.89 arc-90 27.03,5.84 R36.1
A7_B  (via drill 0.2 pad 0.45)
  Top 0.127: v43.83,5.19 45.38,5.19 45.73,5.54 45.78,5.59 U2.38 | U2.38 | U2.38 46.53,5.54 46.63,5.54 | 46.63,5.54 46.63,5.49 | U2.38 46.63,5.58 46.63,5.54
  Bottom 0.127: v43.83,5.19 43.58,4.94 34.53,4.94 arc-90 34.38,5.09 34.38,5.29 arc90 34.18,5.44 | 34.18,5.44 34.03,5.44 arc90 33.88,5.24 33.88,5.09 arc-90 33.73,4.94 33.48,4.94 arc-90 33.33,5.09 33.33,5.19 arc90 33.18,5.34 | R36.2 31.04,5.84 31.53,5.34 33.18,5.34 | 33.18,5.34 | 33.18,5.34 | 34.18,5.44 | 34.18,5.44
A8  (via drill 0.2 pad 0.45)
  Top 0.064: U1.B72 22.07,9.9 22.08,9.89
  Top 0.127: 22.08,9.89 25.63,6.34 v28.93,6.34 | v28.93,6.34 | v28.93,6.34
  Bottom 0.127: R38.1 v28.93,6.35 v28.93,6.34
A8_B  (via drill 0.2 pad 0.45)
  Top 0.127: v45.13,5.74 45.62,6.23 U2.39
  Bottom 0.127: R38.2 31.28,6.35 31.88,5.74 35.63,5.74 arc-90 35.78,5.59 35.78,5.44 arc90 35.88,5.34 36.18,5.34 arc90 36.28,5.44 36.28,5.59 arc-90 36.38,5.74 36.53,5.74 arc-90 36.68,5.54 36.68,5.39 arc90 36.73,5.34 43.18,5.34 43.58,5.74 v45.13,5.74
A9  (via drill 0.2 pad 0.45)
  Top 0.127: U1.A83 22.32,10 25.48,6.84 v26.33,6.84
  Bottom 0.127: R40.1 26.32,6.85 v26.33,6.84
A9_B  (via drill 0.2 pad 0.45)
  Top 0.127: v45.68,6.84 | v45.68,6.84 46.43,6.84 46.52,6.84 U2.40
  Bottom 0.127: v45.68,6.84 44.93,6.09 43.33,6.09 42.93,5.69 39.53,5.69 arc-90 39.43,5.79 39.43,5.89 arc90 39.23,6.09 39.08,6.09 arc90 38.93,5.94 38.93,5.84 arc-90 38.78,5.69 38.58,5.69 arc-90 38.43,5.84 38.43,5.89 arc90 38.23,6.09 37.93,6.09 arc90 37.78,5.94 37.78,5.84 arc-90 37.63,5.69 37.28,5.69 arc-90 37.13,5.84 37.13,5.89 arc90 36.98,6.09 32.28,6.09 31.52,6.85 R40.2
A10/AP  (via drill 0.2 pad 0.45)
  Top 0.064: U1.B3 26.16,13.01
  Top 0.127: 26.16,13.01 26.48,12.69 28.83,12.69 v29.08,12.94
  Bottom 0.127: v29.08,12.94 29.53,12.94 R42.1
A10_B/AP_B  (via drill 0.2 pad 0.45)
  Top 0.127: U2.28 36.82,6.23 40.38,9.79 40.38,12.79 v40.43,12.84
  Bottom 0.127: v40.43,12.84 39.78,12.19 35.98,12.19 34.58,13.59 32.98,13.59 arc90 32.68,13.29 32.68,13.09 arc-90 32.53,12.99 31.68,12.99 arc-90 31.63,13.04 31.63,13.54 arc90 31.48,13.69 31.33,13.69 arc90 31.23,13.59 31.23,12.99 arc-90 31.18,12.94 31.08,12.94 arc-90 30.88,13.14 30.88,13.54 arc90 30.73,13.69 30.43,13.69 arc90 30.33,13.59 30.33,13.04 arc90 30.38,12.99 30.38,12.95 R42.2
A11  (via drill 0.2 pad 0.45)
  Top 0.064: 22.63,10.04 22.57,10.1 U1.B73
  Top 0.127: 22.63,10.04 25.28,7.39 v29.03,7.39
  Bottom 0.127: R44.1 29.5,7.39 v29.03,7.39 | v29.03,7.39 | v29.03,7.39 v28.98,7.39
A11_B  (via drill 0.2 pad 0.45)
  Top 0.127: U2.41 45.22,7.54 v44.58,6.89
  Bottom 0.127: R44.2 31.56,7.36 32.43,6.49 39.63,6.49 39.78,6.49 arc-90 39.93,6.29 39.93,6.24 arc90 40.13,6.09 40.43,6.09 arc90 40.63,6.29 40.63,6.34 arc-90 40.73,6.44 41.03,6.44 arc-90 41.23,6.29 41.23,6.24 arc90 41.33,6.09 41.73,6.09 arc90 41.88,6.29 arc-90 42.03,6.44 42.18,6.44 arc-90 42.38,6.29 42.38,6.19 arc90 42.48,6.09 42.88,6.09 43.23,6.44 44.13,6.44 v44.58,6.89
A12  (via drill 0.2 pad 0.45)
  Top 0.064: U1.B74 23.07,9.95
  Top 0.127: 23.07,9.95 25.18,7.84 v26.23,7.84
  Bottom 0.127: v26.23,7.84 26.26,7.87 26.95,7.87 26.98,7.84 R46.1
A12_B  (via drill 0.2 pad 0.45)
  Top 0.127: U2.42 45.67,8.19 45.63,8.14 v45.63,8.13 v45.64,8.13
  Bottom 0.127: v45.64,8.13 45.12,8.13 43.83,6.84 36.83,6.84 36.78,6.84 arc-90 36.63,6.99 36.63,7.04 arc90 36.48,7.19 36.28,7.19 arc90 36.13,7.04 36.13,6.99 arc-90 35.98,6.84 32.98,6.84 arc-90 32.78,7.04 32.78,7.39 arc90 32.68,7.49 31.98,7.49 31.6,7.87 R46.2
ANT1
  Bottom 0.406: AN1.RF 5.98,5.29 C32.2 5.98,7.75 C29.2
ANT1_INN
  Top 0.127: C33.2 11.93,11.45 11.93,11.54
  Top 0.175: U1.A64 13.18,12.24 11.93,11.54 12.08,11.34 13.13,12.24 11.98,11.49
  Top 0.406: C33.2 10.84,11.45 | 10.84,11.45 10.83,11.44 | 10.84,11.45 10.75,11.45 L8.1
ANT1_INP
  Top 0.127: 12.18,10.69 11.85,10.69 C33.1
  Top 0.175: U1.A65 13.33,11.74 | 13.33,11.74 12.18,10.69 12.18,10.54 13.33,11.74 | 13.33,11.74 12.38,10.59
  Top 0.406: 12.24,10.65 C33.1 11.91,10.65 L6.1
ANT1_INT  (via drill 0.2 pad 0.45)
  Top 0.406: J1.2 2.13,20 v2.13,21.74 | v2.13,21.74 | v2.13,21.74
  Bottom 0.406: C29.1 5.04,8.55 | 5.04,8.55 5.03,8.54 | 2.13,10.74 4.32,8.55 C31.1 5.04,8.55 | 2.13,21.64 2.13,21.49 | 2.13,21.49 2.13,10.74 | 2.13,10.74 | v2.13,21.74 | v2.13,21.74 2.13,21.49
ANT1_OUTN
  Top 0.127: C22.2 12,13.89 11.98,13.89
  Top 0.175: U1.A62 13.48,13.29 11.98,13.99 12.08,13.74 13.43,13.19 C22.2 11.98,13.89 | 11.98,13.89 11.98,13.94 11.98,13.89
  Top 0.406: 11.98,13.89 11.48,14.14 11.4,14.23 L4.1 9.89,14.28 | 9.89,14.28 C25.2 | C23.2 9.89,14.17 9.89,14.28
ANT1_OUTP
  Top 0.127: 12.08,13.09 12.03,13.09 C22.1
  Top 0.175: U1.A63 13.03,12.79 12.13,13.19 12.08,12.99 13.13,12.74 12.08,13.09
  Top 0.406: C22.1 11.99,13.1 L2.2 10.72,13.22 C23.1 8.72,13.37 C19.2
BA0  (via drill 0.2 pad 0.45)
  Top 0.127: U2.26 36.02,7.54 38.83,10.34 38.83,13.74 v39.53,14.44 | U1.A6 27.5,13.76 v27.93,14.19
  Bottom 0.127: v27.93,14.19 28.68,14.94 35.03,14.94 35.78,14.19 38.43,14.19 39.28,14.19 v39.53,14.44
BA1  (via drill 0.2 pad 0.45)
  Top 0.127: U2.27 35.92,6.88 39.18,10.14 39.18,13.44 v39.58,13.84 | U1.B4 24.2,13.51 v24.13,13.44
  Bottom 0.127: v39.58,13.84 35.63,13.84 34.88,14.59 28.98,14.59 28.13,13.74 24.68,13.74 24.38,13.44 v24.13,13.44
CKE  (via drill 0.2 pad 0.45)
  Top 0.127: U2.44 45.77,9.48 45.67,9.38 44.28,7.99 v43.33,7.99 | v33.58,7.94 33.58,7.99 33.18,8.39 25.03,8.39 23.32,10.1 U1.A85
  Bottom 0.127: v33.58,7.94 43.33,7.94 v43.33,7.99
CLK
  Top 0.064: U1.B75 23.57,10.3
  Top 0.127: 23.57,10.3 24.43,9.44 26.56,9.44 R56.1
CLK_B  (via drill 0.2 pad 0.45)
  Top 0.127: U2.45 45.27,10.13 v45.23,10.09 | v45.23,10.09 | v45.23,10.09 | R56.2 28.31,9.54 30.28,9.54 | v30.78,9.04 30.28,9.54 | 30.28,9.54
  Bottom 0.127: R55.1 C6.1 45.41,9.91 v45.23,10.09 45.08,10.09 44.88,10.09 44.08,9.29 43.73,9.29 31.13,9.29 31.03,9.29 v30.78,9.04
D+  (via drill 0.2 pad 0.45)
  Top 0.127: R101.1 11.38,23.93 11.38,25.04 13.78,27.44 13.78,29.06 | 13.78,29.06 13.78,29.09 | 13.78,31.49 13.78,29.16 13.78,29.09 | 13.78,31.49 13.78,32.04 12.81,33.01 USB2.3 | R104.1 13.78,29.06 | 13.78,29.06 13.78,29.09 | v13.33,31.54 13.78,31.54 13.78,31.49
  Bottom 0.406: D2.3 13.35,31.59 13.31,31.55 v13.33,31.55 v13.33,31.54
D-  (1 unrouted)
  Top 0.127: R102.1 11.63,23.66 11.63,24.89 14.08,27.34 14.08,29.09 | R103.1 14.08,29.06 14.08,29.09 | 14.08,29.09 14.08,32.09 14.08,32.14 13.01,33.22 12.98,33.24 | 13.33,33.49 13.48,33.49 12.98,33.49 12.98,33.24 | USB2.2 12.98,33.24 | 12.98,33.24
  Top 0.406: 13.48,33.55 13.48,33.49
DQ0
  Top 0.064: U1.B12 25.85,17.51 25.88,17.54
  Top 0.127: R21.2 29.15,18.26 28.83,17.94 26.28,17.94 | 26.28,17.94 | 26.28,17.94 25.88,17.54
DQ0_B
  Top 0.127: R21.1 31.95,20.37 34.73,23.14 35.28,23.14 35.29,23.14 U2.2
DQ1
  Top 0.127: U1.A13 26,17.26 26.43,17.69 29.39,17.69 R23.2
DQ1_B
  Top 0.127: R23.1 32.24,17.8 arc90 32.43,17.99 32.43,20.29 33.93,21.79 33.98,21.84 34.98,21.84 | 34.98,21.84 35.33,21.84 | U2.4 35.33,21.84 | 35.33,21.84 | 35.33,21.84 34.98,21.84
DQ2
  Top 0.064: U1.B11 26.15,17.01
  Top 0.127: R25.2 31.03,17.39 26.53,17.39 26.15,17.01 | 26.15,17.01
DQ2_B
  Top 0.127: R25.1 32.56,17.27 arc90 32.73,17.49 32.73,19.99 33.93,21.19 34.98,21.19 | 34.98,21.19 35.23,21.19 35.28,21.19 U2.5 | U2.5 | U2.5 | U2.5 34.98,21.19
DQ3
  Top 0.064: U1.B10 26.65,16.51 26.68,16.54
  Top 0.127: R27.2 29.38,16.79 29.13,16.54 26.68,16.54
DQ3_B
  Top 0.127: R27.1 32.68,16.79 arc90 33.08,17.14 33.08,19.84 33.33,20.09 33.93,20.09 34.13,19.89 34.14,19.89 U2.7
DQ4
  Top 0.127: U1.A11 R29.2
DQ4B
  Top 0.127: R29.1 33.2,16.26 arc90 33.38,16.44 33.38,19.54 arc-90 33.58,19.69 33.68,19.69 arc-90 33.83,19.49 33.83,19.09 arc90 33.98,18.94 34.08,18.94 arc90 34.18,19.09 arc-90 34.33,19.24 34.98,19.24 | 34.98,19.24 U2.8 | U2.8 | U2.8 | U2.8 34.98,19.24
DQ5
  Top 0.064: U1.B9 26.41,16.01 26.43,15.99
  Top 0.127: R31.2 29.24,16.01 26.41,16.01
DQ5_B
  Top 0.127: R31.1 32.44,15.75 arc90 32.53,15.79 arc-90 32.59,15.85 32.64,15.85 33.59,15.85 arc90 33.78,15.94 33.78,18.44 arc-90 33.88,18.59 34.13,18.59 arc-90 34.28,18.44 34.28,17.99 arc90 34.48,17.89 35.13,17.89 arc-90 35.18,17.84 35.32,17.84 U2.10
DQ6
  Top 0.127: U1.A10 26.31,15.76 26.33,15.74 28.58,15.74 29.08,15.24 R33.2
DQ6_B
  Top 0.127: 34.58,17.29 arc90 34.48,17.34 34.28,17.34 arc90 34.08,17.14 34.08,15.19 arc-90 34.03,15.14 33.78,15.14 arc-90 33.73,15.24 33.73,15.39 arc90 33.58,15.49 33.48,15.49 arc90 33.38,15.34 33.38,15.24 arc-90 33.28,15.14 33.18,15.14 arc-90 33.08,15.29 33.08,15.39 arc90 32.93,15.49 32.78,15.49 arc90 32.68,15.39 32.68,15.19 arc-90 32.58,15.04 32.23,15.04 32.03,15.04 31.93,15.14 31.95,15.16 R33.1 | U2.11 34.58,17.29 | 34.58,17.29 | 34.58,17.29
DQ7
  Top 0.064: U1.B8 26.06,15.51 26.13,15.44
  Top 0.127: R35.2 29.12,14.75 28.43,15.44 26.13,15.44
DQ7_B
  Top 0.127: R35.1 33.37,14.75 arc-90 33.58,14.49 33.58,13.69 arc90 33.73,13.59 33.83,13.59 arc90 33.98,13.74 33.98,14.44 arc-90 34.23,14.64 arc90 34.38,14.74 34.38,15.79 arc-90 34.43,15.94 35.13,15.94 arc90 35.18,15.99 U2.13
DQ8  (via drill 0.2 pad 0.45)
  Top 0.127: U1.B14 24.25,18.51 v24.13,18.39
  Bottom 0.127: v24.13,18.39 24.18,18.44 28.23,18.44 29.78,19.99 40.48,19.99 40.53,19.94 40.57,19.94 R37.1
DQ8_B  (via drill 0.2 pad 0.45)
  Top 0.127: v41.98,19.94 41.98,19.34 45.33,15.99 | 45.33,15.99 45.34,15.99 | 45.34,15.99 45.33,15.99 | U2.54 45.34,15.99 | 45.34,15.99 45.33,15.99
  Bottom 0.127: R37.2 v41.97,19.94 | v41.97,19.94 v41.98,19.94 v41.97,19.94 | v41.97,19.94
DQ9  (via drill 0.2 pad 0.45)
  Top 0.127: v30.88,20.99 30.48,20.59 30.13,20.59 28.23,18.69 25.78,18.69 25.71,18.76 U1.A16
  Bottom 0.127: R39.1 31.02,21.08 30.93,20.99 | v30.88,20.99 30.93,20.99 | 30.93,20.99
DQ9_B  (via drill 0.2 pad 0.45)
  Top 0.127: U2.56 45.64,17.29 43.53,19.39 43.53,20.34 v43.53,20.44
  Bottom 0.127: v43.53,20.44 43.53,21.09 | 43.53,21.09 | 43.53,21.09 43.57,21.09 R39.2
DQ10  (via drill 0.2 pad 0.45)
  Top 0.064: U1.B15 25.96,19.01 26.03,18.94
  Top 0.127: 26.03,18.94 27.88,18.94 v30.33,21.39
  Bottom 0.127: R41.1 40.38,21.39 40.18,21.39 30.43,21.39 v30.33,21.39
DQ10_B  (via drill 0.2 pad 0.45)
  Top 0.127: U2.57 45.54,17.94 43.98,19.49 43.98,20.99 43.38,21.59 v42.03,21.59 | v42.03,21.59
  Bottom 0.127: R41.2 v42.02,21.59 | v42.02,21.59 v42.03,21.59 v42.02,21.59 | v42.02,21.59
DQ11  (via drill 0.2 pad 0.45)
  Top 0.127: U1.A17 26.06,19.26 26.13,19.19 27.58,19.19 30.23,21.84 | 31.43,21.84 | 30.23,21.84 | 30.23,21.84 v31.33,21.84 31.43,21.84 | 31.43,21.84
  Bottom 0.127: R43.1 39.98,22.09 39.73,21.84 39.58,21.69 32.13,21.69 31.83,21.69 | v31.33,21.84 31.48,21.69 31.78,21.69 | 31.83,21.69 31.78,21.69 | 31.78,21.69 | 31.78,21.69 | 31.78,21.69 31.83,21.69
DQ11_B  (via drill 0.2 pad 0.45)
  Top 0.127: U2.59 44.69,19.24 44.38,19.54 44.38,19.79 arc-90 44.58,19.94 arc90 44.73,20.04 44.73,20.24 arc90 44.58,20.34 44.53,20.34 arc-90 44.38,20.49 44.38,20.54 arc-90 44.53,20.74 44.63,20.74 arc90 44.63,21.09 v44.13,21.59
  Bottom 0.127: R43.2 43.63,22.09 v44.13,21.59
DQ12  (via drill 0.2 pad 0.45)
  Top 0.064: U1.B16 26.16,19.51
  Top 0.127: 26.16,19.51 26.23,19.44 27.38,19.44 30.18,22.24 32.23,22.24 v32.18,22.19
  Bottom 0.127: v32.18,22.19 32.33,22.04 39.53,22.04 40.08,22.59 40.53,22.59 40.56,22.59 R45.1
DQ12_B  (via drill 0.2 pad 0.45)
  Top 0.127: U2.60 45.29,19.89 45.03,20.14 45.03,21.39 43.98,22.44 43.83,22.59 v41.98,22.59
  Bottom 0.127: R45.2 41.97,22.6 v41.98,22.59
DQ13  (via drill 0.2 pad 0.45)
  Top 0.127: U1.A18 26.95,19.76 v27.63,20.44
  Bottom 0.127: R47.1 39.81,23.11 39.68,23.24 30.28,23.24 29.93,22.89 29.93,22.39 29.38,21.84 29.08,21.84 28.53,21.29 28.53,20.69 28.33,20.49 28.28,20.44 v27.63,20.44
DQ13_B  (via drill 0.2 pad 0.45)
  Top 0.127: U2.62 45.79,21.19 44.73,22.24 44.73,22.79 arc90 44.58,22.99 v44.18,22.99
  Bottom 0.127: v44.18,22.99 43.68,22.99 43.58,23.09 43.58,23.1 R47.2
DQ14  (via drill 0.2 pad 0.45)
  Top 0.064: U1.B17 26.7,20.01
  Top 0.127: 26.7,20.01 27.93,21.24 v27.98,21.24
  Bottom 0.127: 30.11,23.52 27.98,21.39 v27.98,21.24 | R48.1 40.5,23.54 30.13,23.54 | 30.13,23.54 30.08,23.49 | 30.11,23.52 | 30.11,23.52 30.13,23.54
DQ14_B  (via drill 0.2 pad 0.45)
  Top 0.127: U2.63 45.59,21.84 45.03,22.39 45.03,23.39 arc90 44.73,23.64 43.58,23.64 arc90 43.48,23.44 43.48,23.29 arc-90 43.38,23.14 42.93,23.14 arc-90 42.78,23.24 42.78,23.44 arc90 42.53,23.64 v41.98,23.64
  Bottom 0.127: R48.2 41.4,23.59 42.03,23.59 | 42.03,23.59 | 42.03,23.59 v41.98,23.64
DQ15  (via drill 0.2 pad 0.45)
  Top 0.064: U1.B18 25.9,20.51
  Top 0.127: 25.9,20.51 27.63,22.24 v28.23,22.24
  Bottom 0.127: R49.1 39.96,24.13 39.68,23.84 29.68,23.84 28.23,22.39 v28.23,22.24
DQ15_B  (via drill 0.2 pad 0.45)
  Top 0.127: U2.65 45.69,23.14 arc-90 45.58,23.24 45.58,23.79 arc90 45.18,24.19 v44.08,24.19
  Bottom 0.127: R49.2 43.65,24.19 v44.08,24.19 | v44.08,24.19 | v44.08,24.19
ETH_GND
  Bottom 0.127: 33.53,36.44 33.44,36.44 R68.2 | R65.2 30.83,36.5 30.83,36.44 | 26.43,36.44 26.32,36.44 R71.1 | 20.08,36.44 R64.1
  Bottom 0.406: 26.52,36.44 30.78,36.44 30.83,36.44 33.53,36.44 35.48,36.44 35.76,36.44 36.38,36.44 C45.2 | 26.52,36.44 26.43,36.44 | 26.52,36.44 26.43,36.44 | 26.43,36.44 20.08,36.44
FB
  Bottom 0.406: 6.38,34.16 C106.1 R99.1 R100.2 6.36,37.21
  Bottom 0.5: 6.36,37.21 4.23,39.35 U5.5
GND  (via drill 0.2 pad 0.45, 0.3, 0.3 pad 0.2, 0.3 pad 0.3, 0.3 pad 0.45, 0.3 pad 0.5, 0.4 pad 0.5)
  Top 0.127: U1.A74 17.82,9.45 v18.33,8.94 | R92.1 C62.1 5.99,41.6 v5.73,41.34 | R15.1 7.53,20.57 7.53,20.59 | R52.2 32.23,13.47 v32.23,13.49 | v36.63,17.09 36.07,16.64 U2.12 | C48.1 18.78,24.89
  Top 0.254: 5.38,16.04 5.38,15.15 L5.2 3.98,15.15 3.98,15.39
  Top 0.406: v18.33,8.94 19.08,8.19 C61.2 19.35,7.82 v19.73,7.44 | R17.1 9.34,20.84 v9.23,20.94 | v25.73,43.94 25.73,41.89 v24.83,40.99 24.73,40.89 v23.23,40.89 | 7.53,20.59 7.38,20.74 v7.38,21.14 | C52.1 18.78,24.85 18.78,24.89
  Top 0.5: R11.1 21.73,4.71 21.27,4.71 20.67,4.71 20.67,4.76
  Top 0.6: v15.88,47.19 v16.78,47.19 | v16.78,47.19
  Top 1: Y1.2 15.43,6.36 15.43,6.34 | Y1.4 20.08,4.71 v20.08,5.04
  Top 3: U1.PAD 18.57,15.51 18.57,15.06
  Bottom 0.127: C97.2 11.58,19.94 11.58,19.99 | 17.33,19.84 17.13,19.84 C3.2
  Bottom 0.254: 11.53,20.79 11.53,19.99 11.58,19.99
  Bottom 0.406: 21.68,22.34 21.68,22.73 21.68,22.68 C105.2 | 17.33,19.84 v17.33,18.84 17.28,18.79 | 17.33,19.84 | C82.1 17.23,14.42 v17.23,14.84 | 17.33,19.84 17.38,19.89 C77.1
  Bottom 0.6: TPGND.1 7.08,33.2 7.08,31.84
  Bottom 0.8: C110.2 3.33,28.99 3.53,29.19
  Bottom 1.1: AN1.GND 3.48,6.34 v3.03,6.34
  Bottom 2: v18.58,15.04 18.58,15.52
  Bottom 3: 18.58,15.52 U1.PAD
  other vias: 47.73,5.94 47.73,9.09 47.73,3.89 44.93,0.99 41.78,0.84 38.08,0.84 34.33,0.79 30.53,1.14 35.43,2.29 31.98,3.29 41.68,3.14 45.43,2.89 38.53,3.04 47.73,12.04 44.98,9.39 42.43,8.69 38.63,8.74 36.63,8.74 33.98,8.84 31.98,8.89 37.33,7.39 40.73,7.49 42.93,7.39 44.53,11.69 42.98,10.14 39.83,10.09 37.98,10.14 33.98,10.19 31.93,10.14 28.73,13.54 24.93,10.44 28.53,10.29 27.43,10.79 25.78,10.69 25.13,8.99 26.23,8.99 28.63,8.89 29.83,8.89 38.33,12.69 38.48,14.74 40.38,15.64 39.18,17.04 37.68,17.59 38.98,18.94 40.63,17.29 40.28,14.24 39.73,12.84 31.48,20.59 33.33,22.64 31.78,22.74 30.53,22.74 38.43,22.64 39.78,20.54 36.53,20.54 42.68,17.84 42.98,15.04 42.28,13.84 41.58,12.64 42.53,11.64 45.23,13.64 44.78,15.69 44.78,17.49 42.93,19.44 47.78,22.49 47.73,19.74 47.68,18.54 47.78,15.69 47.73,14.69 47.78,12.84 25.93,21.34 26.68,22.09 25.23,24.39 27.08,24.19 27.88,24.34 28.63,23.69 28.78,24.44 30.23,24.89 33.13,24.44 35.18,24.64 37.58,25.64 22.73,14.14 21.28,14.14 19.93,14.14 21.13,15.29 22.23,16.14 21.88,17.09 20.53,18.14 21.23,18.99 24.13,16.69 24.03,15.74 22.68,18.94 39.93,26.54 38.43,24.44 40.73,24.64 36.43,28.84 39.33,28.99 38.48,30.74 36.43,30.74 33.23,28.69 35.03,26.14 31.93,26.54 31.83,30.59 30.53,28.69 28.53,27.54 28.48,26.49 28.83,30.89 25.88,30.49 27.23,28.99 25.73,29.04 40.48,30.99 41.43,28.29 42.23,30.89 46.68,24.49 47.73,27.04 45.23,25.14 45.18,28.34 47.73,30.59 47.73,34.14 47.58,37.59 47.58,40.89 47.53,44.24 44.58,47.04 46.03,40.39 44.08,40.59 46.13,35.99 44.38,36.84 44.18,34.69 44.98,32.89 43.18,32.09 38.28,32.89 39.83,33.44 39.83,34.44 38.08,35.44 36.63,33.89 34.88,32.54 31.93,32.54 28.78,32.44 26.08,32.54 23.38,32.49 23.38,29.09 23.38,30.49 20.83,29.04 21.13,30.49 21.23,32.54 19.33,29.19 18.83,30.84 19.43,32.54 17.83,29.79 17.53,31.54 17.93,32.54 17.03,33.79 28.63,0.79 34.03,7.39 25.03,3.99 21.93,3.89 21.13,4.29 20.08,4.24 17.13,8.59 15.63,7.59 14.68,8.39 14.73,7.54 15.43,6.79 15.38,5.89 14.18,5.79 15.48,3.89 13.83,3.99 12.83,6.94 12.48,9.64 11.53,7.99 11.28,6.44 11.58,4.04 10.18,4.14 10.53,9.49 8.23,9.54 7.13,8.24 7.23,6.19 5.23,6.04 3.93,6.34 4.28,7.89 5.88,9.74 1.18,6.24 1.18,7.99 1.18,9.74 4.68,10.79 5.38,12.04 4.13,12.49 3.08,12.44 3.28,11.44 1.08,11.54 1.08,12.54 1.08,13.84 1.08,15.74 1.03,17.24 2.93,17.14 3.93,18.84 3.83,17.84 6.58,17.54 6.83,18.24 9.33,15.39 19.38,18.94 18.43,18.94 18.28,17.89 17.28,17.84 17.18,16.99 17.18,15.74 15.13,13.29 19.48,12.29 4.48,19.49 5.28,19.74 3.63,20.34 3.98,22.84 3.38,21.89 2.28,23.04 1.73,24.19 1.73,24.99 1.03,19.19 1.08,21.04 1.13,22.29 3.63,43.94 3.68,44.59 3.18,45.39 6.68,37.94 5.58,39.04 4.48,40.14 3.58,40.29 2.88,37.64 1.18,39.59 1.13,41.54 1.23,37.04 13.98,36.24 14.63,35.29 14.88,37.09 16.28,37.29 16.33,36.04 12.83,34.49 14.88,33.34 14.23,32.69 14.63,30.54 13.18,30.54 15.93,40.24 17.48,42.19 14.98,41.69 7.08,36.09 5.63,36.69 3.43,35.99 4.58,35.09 6.98,34.09 6.83,32.79 7.58,32.74 1.23,32.04 1.23,34.84 4.88,29.54 1.53,29.19 3.28,28.79 4.03,28.84 1.18,26.94 12.33,28.09 11.58,26.39 10.88,25.44 10.58,24.09 16.08,28.99 15.33,28.99 14.53,27.29 13.88,26.34 12.58,25.14 18.13,26.39 17.98,27.24 12.53,22.99 15.73,42.64 15.78,43.84 14.73,43.94 10.03,47.09 3.08,15.44 3.83,15.39 10.98,19.89 9.53,22.74 10.38,22.99 10.88,20.94 10.93,21.94 12.48,21.59 24.98,22.99 24.48,22.19 13.63,10.59 22.58,25.99 18.13,23.04 19.03,24.14 17.08,25.39 15.83,23.14 16.28,25.39 15.63,24.14 13.08,36.29 12.38,40.54 11.98,39.59 10.18,15.74 42.73,27.14 19.18,42.39 29.73,10.29 8.13,12.39 9.38,12.39 11.93,12.34 12.43,14.49 11.98,18.79 21.73,23.04 24.03,19.04
  pour Top: 43.57,50.51 48.97,50.51 48.97,-0.49 -0.03,-0.51 -0.03,45.84 9.48,45.79 9.43,47.94 11.43,47.99 11.48,45.44 8.58,42.59 12.68,42.64 15.28,45.24 15.23,47.09 17.58,47.09 17.63,47.09 18.03,47.09 18.03,46.94 18.28,44.04 19.03,44.04 19.03,42.94 20.08,41.14 43.58,41.34
  pour Bottom (rank 2): -0.03,50.51 48.97,50.51 48.97,-0.49 -0.03,-0.49
GPIO0
  Top 0.127: R4.1 23.93,4.65 23.93,5.44 19.82,9.55 U1.A78
GPIO1  (via drill 0.2 pad 0.45)
  Top 0.127: U1.A77 19.32,10.45 19.58,10.19 19.58,9.39 21.58,7.39 23.38,5.59 23.38,5.24 v23.33,5.19
  Bottom 0.127: R2.2 23.32,5.6 23.32,5.21 v23.32,5.19 v23.33,5.19
GPIO6
  Top 0.064: U1.B46 13.26,17.51 13.18,17.59
  Top 0.127: 13.18,17.59 11.33,17.59 10.28,18.64 9.13,18.64 8.48,19.29 8.48,19.68 R16.2
GPIO7
  Top 0.127: U1.A54 11.26,17.26 10.13,18.39 8.63,18.39 7.56,19.46 R15.2
GPIO8
  Top 0.127: 11.58,18.09 11.63,18.09 13.38,18.09 13.55,18.26 U1.A52 | R18.2 10.03,20.76 10.03,19.64 11.58,18.09 | 11.58,18.09
GPIO11
  Top 0.064: U1.B48 12.86,16.51 12.63,16.74
  Top 0.127: 12.63,16.74 11.43,16.74 10.03,18.14 8.33,18.14 6.63,19.84 6.63,21.94 5.48,23.09 5.48,29.69 8.58,32.79 8.58,36.94 6.33,39.19 6.33,41.54 6.79,42 R92.2 C62.2 7.59,44.22 SW2.3
GPIO13  (via drill 0.2 pad 0.45)
  Top 0.064: U1.B66 19.07,10.35
  Top 0.127: 19.07,10.35 19.33,10.09 19.33,9.29 22.63,5.99 v22.63,5.19
  Bottom 0.127: R3.2 22.63,5.25 22.63,5.24 | 22.63,5.24 | 22.63,5.24 v22.63,5.19
GPIO14
  Top 0.127: U1.A76 18.82,10.25 19.08,9.99 19.08,9.19 21.73,6.54 R11.2
GPIO15
  Top 0.064: U1.B65 18.57,10.1
  Top 0.127: 18.57,10.1 18.83,9.84 18.83,9.09 21.13,6.79 21.13,6.15 R12.2
GPIO16  (via drill 0.2 pad 0.45)
  Top 0.127: U1.A75 18.32,9.65 v18.38,9.59 | v18.38,9.59 | v18.38,9.59
  Bottom 0.127: R13.1 20.69,5.68 19.23,7.14 19.23,8.74 v18.38,9.59
GPIO17  (via drill 0.2 pad 0.45)
  Top 0.127: U1.B64 18.07,11.68 v18.38,11.99
  Bottom 0.127: R14.1 18.83,9.69 18.83,11.49 | v18.38,11.99 18.83,11.54 18.83,11.49 | 18.83,11.49 18.83,11.44 | 18.83,11.49
GPIO29
  Top 0.127: R17.2 9.71,19.56 11.43,17.84 13.23,17.84 13.31,17.76 U1.A53
LDM
  Top 0.064: U1.B7 25.86,15.01
  Top 0.127: 25.86,15.01 25.93,14.94 28.03,14.94 29.03,13.94 30.48,13.94 30.88,13.54 31.48,13.54 32.33,12.69 32.78,12.69 32.93,12.54 32.93,11.54 arc90 33.13,11.39 33.38,11.39 arc90 33.48,11.49 33.48,11.74 arc-90 33.58,11.84 33.98,11.84 arc-90 34.13,11.69 34.13,11.49 arc90 34.28,11.34 34.93,11.34 arc-90 34.98,11.34 35.23,11.34 | 35.23,11.34 U2.20 35.23,11.34
LDO  (via drill 0.2 pad 0.45)
  Top 0.127: v11.23,40.39 11.23,39.89 8.93,37.59 8.93,32.69 5.78,29.54 5.78,23.29 8.4,20.68 R16.1
  Bottom 0.127: R108.1 13.93,39.98 | R108.1 13.93,39.99 | R107.1 13.98,40.13 | 13.98,40.13 13.98,40.19 | R108.1 R110.1 11.49,40.13 v11.23,40.39 | 13.98,40.13 R108.1
LDQS
  Top 0.127: U1.A9 25.96,15.26 26.03,15.19 28.23,15.19 29.2,14.22 R50.2
LDQS_B